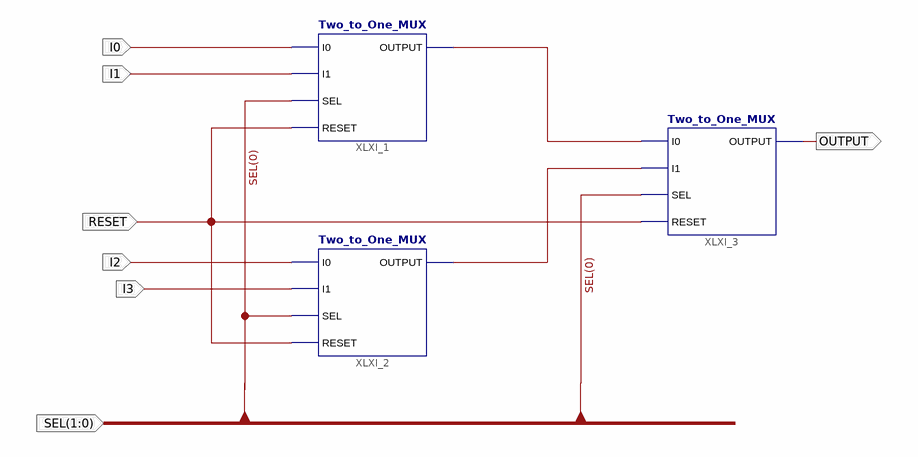
[diagram p0: schematic sheet 1]
// Xilinx ISE schematic Four_to_One_MUX.sch (spartan6) as structural Verilog: 3 symbols, 7 ports
module Four_to_One_MUX (
  input  [1:0] SEL,
  input  I0,
  input  I1,
  input  I3,
  input  RESET,
  input  I2,
  output OUTPUT
);

  wire XLXN_11, XLXN_12;

  Two_to_One_MUX XLXI_1 (.I0(I0), .I1(I1), .OUTPUT(XLXN_11), .RESET(RESET), .SEL(SEL[0]));
  Two_to_One_MUX XLXI_2 (.I0(I2), .I1(I3), .OUTPUT(XLXN_12), .RESET(RESET), .SEL(SEL[0]));
  Two_to_One_MUX XLXI_3 (.I0(XLXN_11), .I1(XLXN_12), .OUTPUT(OUTPUT), .RESET(RESET), .SEL(SEL[0]));
endmodule
